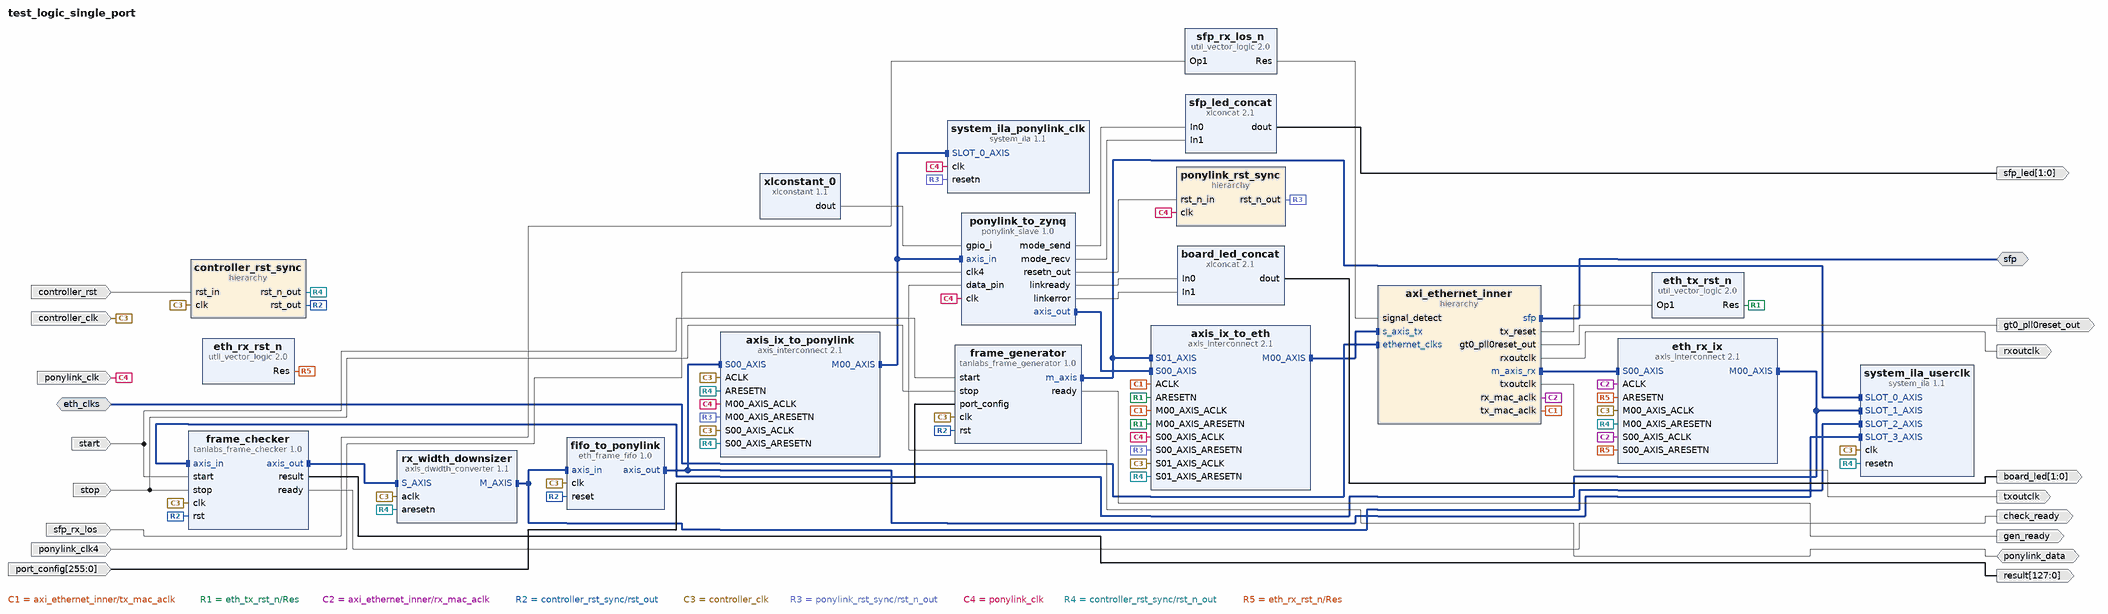
[diagram p0: block diagram of the top level]
# Vivado block design test_logic_single_port, xc7a200tfbg676-2, Vivado 2019.2
create_bd_design test_logic_single_port

create_bd_intf_port -mode Master -vlnv xilinx.com:interface:sfp_rtl:1.0 sfp
create_bd_intf_port -mode Slave -vlnv harrychen.xyz:user:axi_ethernet_clocks_resets_rtl:1.0 eth_clks
create_bd_port -dir IO -type data ponylink_data
create_bd_port -dir I sfp_rx_los
create_bd_port -dir O -type clk rxoutclk
create_bd_port -dir O -type clk txoutclk
create_bd_port -dir O -type rst gt0_pll0reset_out
create_bd_port -dir I -type data start
create_bd_port -dir I -type data stop
create_bd_port -dir I -from 255 -to 0 -type data port_config
create_bd_port -dir O -from 127 -to 0 -type data result
create_bd_port -dir O -type data check_ready
create_bd_port -dir O -type data gen_ready
create_bd_port -dir O -from 1 -to 0 -type data sfp_led
create_bd_port -dir O -from 1 -to 0 -type data board_led
create_bd_port -dir I -type clk ponylink_clk
set_property -dict {CONFIG.FREQ_HZ 33000000} [get_bd_ports ponylink_clk]
create_bd_port -dir I -type clk ponylink_clk4
set_property -dict {CONFIG.FREQ_HZ 132000000} [get_bd_ports ponylink_clk4]
create_bd_port -dir I -type clk controller_clk
set_property -dict {CONFIG.ASSOCIATED_RESET controller_rst CONFIG.FREQ_HZ 33000000} [get_bd_ports controller_clk]
create_bd_port -dir I -type rst controller_rst
set_property -dict {CONFIG.POLARITY ACTIVE_HIGH} [get_bd_ports controller_rst]

create_bd_cell -type ip -vlnv clifford.at:cliffordwolf:ponylink_slave:1.0 ponylink_to_zynq
set_property -dict [list \
  CONFIG.MASTER_PARBITS 4 \
  CONFIG.MASTER_TIMINGS 0x09070503010907050301 \
  CONFIG.SLAVE_PARBITS 4 \
  CONFIG.SLAVE_TIMINGS 0x0d0a0705020b09060301 \
  CONFIG.TDATA_WIDTH 8 \
  CONFIG.TUSER_WIDTH 1 \
] [get_bd_cells ponylink_to_zynq]
create_bd_cell -type hier axi_ethernet_inner
create_bd_cell -type ip -vlnv xilinx.com:ip:util_vector_logic:2.0 sfp_rx_los_n
set_property -dict {CONFIG.C_OPERATION not CONFIG.C_SIZE 1} [get_bd_cells sfp_rx_los_n]
create_bd_cell -type ip -vlnv xilinx.com:ip:axis_interconnect:2.1 axis_ix_to_eth
set_property -dict [list \
  CONFIG.ARB_ALGORITHM 1 \
  CONFIG.ARB_ON_MAX_XFERS 0 \
  CONFIG.ARB_ON_TLAST 1 \
  CONFIG.ENABLE_ADVANCED_OPTIONS 1 \
  CONFIG.M00_FIFO_DEPTH 4096 \
  CONFIG.M00_FIFO_MODE 1 \
  CONFIG.NUM_MI 1 \
  CONFIG.NUM_SI 2 \
  CONFIG.XBAR_TDATA_NUM_BYTES 1 \
] [get_bd_cells axis_ix_to_eth]
create_bd_cell -type ip -vlnv xilinx.com:ip:xlconstant:1.1 xlconstant_0
set_property -dict {CONFIG.CONST_VAL 0 CONFIG.CONST_WIDTH 8} [get_bd_cells xlconstant_0]
create_bd_cell -type ip -vlnv user.org:user:eth_frame_fifo:1.0 fifo_to_ponylink
set_property -dict {CONFIG.DATA_WIDTH 64} [get_bd_cells fifo_to_ponylink]
create_bd_cell -type ip -vlnv xilinx.com:ip:xlconcat:2.1 sfp_led_concat
create_bd_cell -type ip -vlnv xilinx.com:ip:xlconcat:2.1 board_led_concat
create_bd_cell -type ip -vlnv xilinx.com:ip:axis_dwidth_converter:1.1 rx_width_downsizer
set_property -dict {CONFIG.M_TDATA_NUM_BYTES 8} [get_bd_cells rx_width_downsizer]
create_bd_cell -type ip -vlnv xilinx.com:ip:axis_interconnect:2.1 eth_rx_ix
set_property -dict {CONFIG.NUM_MI 1} [get_bd_cells eth_rx_ix]
create_bd_cell -type hier ponylink_rst_sync
create_bd_cell -type ip -vlnv xilinx.com:ip:axis_interconnect:2.1 axis_ix_to_ponylink
set_property -dict {CONFIG.ARB_ON_MAX_XFERS 0 CONFIG.NUM_MI 1} [get_bd_cells axis_ix_to_ponylink]
create_bd_cell -type ip -vlnv harrychen.xyz:user:tanlabs_frame_checker:1.0 frame_checker
set_property -dict {CONFIG.DATA_WIDTH 512} [get_bd_cells frame_checker]
create_bd_cell -type ip -vlnv harrychen.xyz:user:tanlabs_frame_generator:1.0 frame_generator
set_property -dict {CONFIG.DATA_WIDTH 512} [get_bd_cells frame_generator]
create_bd_cell -type ip -vlnv xilinx.com:ip:util_vector_logic:2.0 eth_tx_rst_n
set_property -dict {CONFIG.C_OPERATION not CONFIG.C_SIZE 1} [get_bd_cells eth_tx_rst_n]
create_bd_cell -type ip -vlnv xilinx.com:ip:util_vector_logic:2.0 eth_rx_rst_n
set_property -dict {CONFIG.C_OPERATION not CONFIG.C_SIZE 1} [get_bd_cells eth_rx_rst_n]
create_bd_cell -type hier controller_rst_sync
create_bd_cell -type ip -vlnv xilinx.com:ip:system_ila:1.1 system_ila_ponylink_clk
set_property -dict [list \
  CONFIG.C_MON_TYPE INTERFACE \
  CONFIG.C_NUM_MONITOR_SLOTS 1 \
  CONFIG.C_SLOT 0 \
  CONFIG.C_SLOT_0_APC_EN 1 \
  CONFIG.C_SLOT_0_AXI_DATA_SEL 1 \
  CONFIG.C_SLOT_0_AXI_TRIG_SEL 1 \
  CONFIG.C_SLOT_0_INTF_TYPE xilinx.com:interface:axis_rtl:1.0 \
  CONFIG.C_SLOT_1_APC_EN 1 \
  CONFIG.C_SLOT_1_INTF_TYPE xilinx.com:interface:axis_rtl:1.0 \
  CONFIG.C_SLOT_2_APC_EN 1 \
  CONFIG.C_SLOT_2_INTF_TYPE xilinx.com:interface:axis_rtl:1.0 \
  CONFIG.C_SLOT_3_APC_EN 0 \
  CONFIG.C_SLOT_3_AXI_DATA_SEL 1 \
  CONFIG.C_SLOT_3_AXI_TRIG_SEL 1 \
  CONFIG.C_SLOT_3_INTF_TYPE xilinx.com:interface:axis_rtl:1.0 \
  CONFIG.C_SLOT_4_APC_EN 1 \
  CONFIG.C_SLOT_4_INTF_TYPE xilinx.com:interface:axis_rtl:1.0 \
] [get_bd_cells system_ila_ponylink_clk]
create_bd_cell -type ip -vlnv xilinx.com:ip:system_ila:1.1 system_ila_userclk
set_property -dict [list \
  CONFIG.C_MON_TYPE INTERFACE \
  CONFIG.C_NUM_MONITOR_SLOTS 4 \
  CONFIG.C_SLOT_0_APC_EN 1 \
  CONFIG.C_SLOT_0_AXI_DATA_SEL 1 \
  CONFIG.C_SLOT_0_AXI_TRIG_SEL 1 \
  CONFIG.C_SLOT_0_INTF_TYPE xilinx.com:interface:axis_rtl:1.0 \
  CONFIG.C_SLOT_1_APC_EN 1 \
  CONFIG.C_SLOT_1_AXI_DATA_SEL 1 \
  CONFIG.C_SLOT_1_AXI_TRIG_SEL 1 \
  CONFIG.C_SLOT_1_INTF_TYPE xilinx.com:interface:axis_rtl:1.0 \
  CONFIG.C_SLOT_2_APC_EN 1 \
  CONFIG.C_SLOT_2_AXI_DATA_SEL 1 \
  CONFIG.C_SLOT_2_AXI_TRIG_SEL 1 \
  CONFIG.C_SLOT_2_INTF_TYPE xilinx.com:interface:axis_rtl:1.0 \
  CONFIG.C_SLOT_3_APC_EN 1 \
  CONFIG.C_SLOT_3_AXI_DATA_SEL 1 \
  CONFIG.C_SLOT_3_AXI_TRIG_SEL 1 \
  CONFIG.C_SLOT_3_INTF_TYPE xilinx.com:interface:axis_rtl:1.0 \
] [get_bd_cells system_ila_userclk]

# ---- hierarchy /axi_ethernet_inner ----
current_bd_instance /axi_ethernet_inner
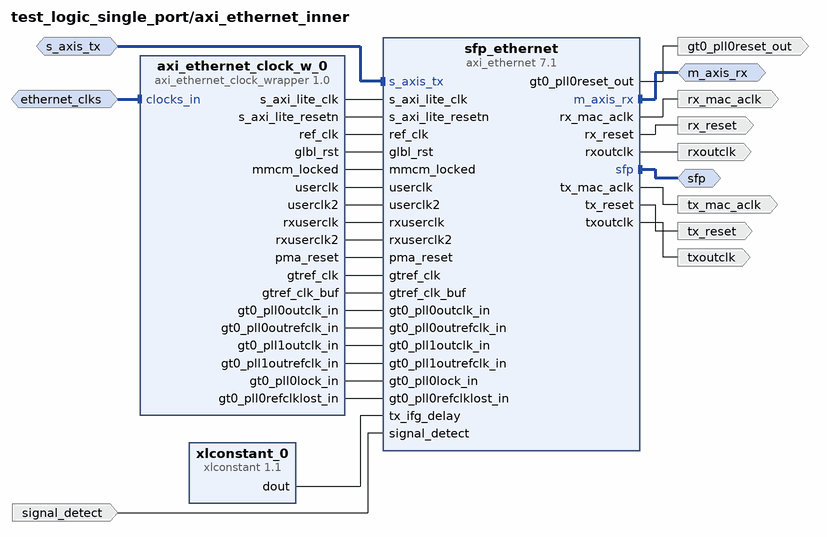
[diagram p1: block diagram inside /axi_ethernet_inner]
create_bd_intf_pin -mode Master -vlnv xilinx.com:interface:axis_rtl:1.0 m_axis_rx
create_bd_intf_pin -mode Slave -vlnv xilinx.com:interface:axis_rtl:1.0 s_axis_tx
create_bd_intf_pin -mode Master -vlnv xilinx.com:interface:sfp_rtl:1.0 sfp
create_bd_intf_pin -mode Slave -vlnv harrychen.xyz:user:axi_ethernet_clocks_resets_rtl:1.0 ethernet_clks
create_bd_pin -dir I signal_detect
create_bd_pin -dir O -type clk tx_mac_aclk
create_bd_pin -dir O -type rst tx_reset
create_bd_pin -dir O -type clk rx_mac_aclk
create_bd_pin -dir O -type rst rx_reset
create_bd_pin -dir O -type clk rxoutclk
create_bd_pin -dir O -type clk txoutclk
create_bd_pin -dir O -type rst gt0_pll0reset_out

create_bd_cell -type ip -vlnv xilinx.com:ip:axi_ethernet:7.1 sfp_ethernet
set_property -dict [list \
  CONFIG.Frame_Filter false \
  CONFIG.PHY_TYPE 1000BaseX \
  CONFIG.SupportLevel 0 \
  CONFIG.axiliteclkrate 200 \
  CONFIG.processor_mode false \
] [get_bd_cells sfp_ethernet]
create_bd_cell -type ip -vlnv xilinx.com:ip:xlconstant:1.1 xlconstant_0
set_property -dict {CONFIG.CONST_VAL 0 CONFIG.CONST_WIDTH 8} [get_bd_cells xlconstant_0]
create_bd_cell -type ip -vlnv harrychen.xyz:user:axi_ethernet_clock_wrapper:1.0 axi_ethernet_clock_w_0

# ---- hierarchy /ponylink_rst_sync ----
current_bd_instance /ponylink_rst_sync
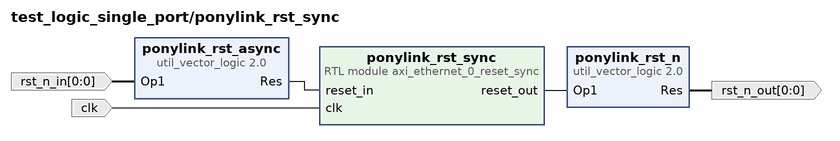
[diagram p2: block diagram inside /ponylink_rst_sync]
create_bd_pin -dir I -type clk clk
create_bd_pin -dir O -from 0 -to 0 rst_n_out
create_bd_pin -dir I -from 0 -to 0 rst_n_in

create_bd_cell -type module -reference axi_ethernet_0_reset_sync ponylink_rst_sync
create_bd_cell -type ip -vlnv xilinx.com:ip:util_vector_logic:2.0 ponylink_rst_n
set_property -dict {CONFIG.C_OPERATION not CONFIG.C_SIZE 1} [get_bd_cells ponylink_rst_n]
create_bd_cell -type ip -vlnv xilinx.com:ip:util_vector_logic:2.0 ponylink_rst_async
set_property -dict {CONFIG.C_OPERATION not CONFIG.C_SIZE 1} [get_bd_cells ponylink_rst_async]

# ---- hierarchy /controller_rst_sync ----
current_bd_instance /controller_rst_sync
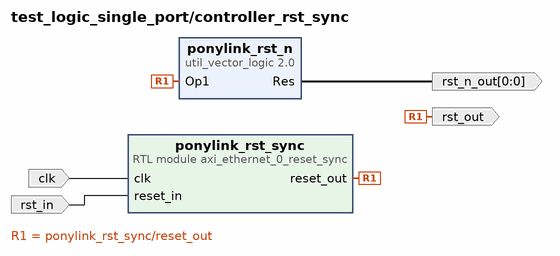
[diagram p3: block diagram inside /controller_rst_sync]
create_bd_pin -dir I -type clk clk
create_bd_pin -dir O -from 0 -to 0 rst_n_out
create_bd_pin -dir O -type rst rst_out
create_bd_pin -dir I -type rst rst_in

create_bd_cell -type module -reference axi_ethernet_0_reset_sync ponylink_rst_sync
create_bd_cell -type ip -vlnv xilinx.com:ip:util_vector_logic:2.0 ponylink_rst_n
set_property -dict {CONFIG.C_OPERATION not CONFIG.C_SIZE 1} [get_bd_cells ponylink_rst_n]

# ---- connections ----

current_bd_instance /axi_ethernet_inner
connect_bd_intf_net [get_bd_intf_pins s_axis_tx] [get_bd_intf_pins sfp_ethernet/s_axis_tx]
connect_bd_intf_net [get_bd_intf_pins ethernet_clks] [get_bd_intf_pins axi_ethernet_clock_w_0/clocks_in]
connect_bd_intf_net [get_bd_intf_pins m_axis_rx] [get_bd_intf_pins sfp_ethernet/m_axis_rx]
connect_bd_intf_net -intf_net axi_ethernet_0_sfp [get_bd_intf_pins sfp] [get_bd_intf_pins sfp_ethernet/sfp]
connect_bd_net [get_bd_pins axi_ethernet_clock_w_0/s_axi_lite_clk] [get_bd_pins sfp_ethernet/s_axi_lite_clk]
connect_bd_net [get_bd_pins axi_ethernet_clock_w_0/s_axi_lite_resetn] [get_bd_pins sfp_ethernet/s_axi_lite_resetn]
connect_bd_net [get_bd_pins axi_ethernet_clock_w_0/ref_clk] [get_bd_pins sfp_ethernet/ref_clk]
connect_bd_net [get_bd_pins axi_ethernet_clock_w_0/glbl_rst] [get_bd_pins sfp_ethernet/glbl_rst]
connect_bd_net [get_bd_pins axi_ethernet_clock_w_0/mmcm_locked] [get_bd_pins sfp_ethernet/mmcm_locked]
connect_bd_net [get_bd_pins axi_ethernet_clock_w_0/userclk] [get_bd_pins sfp_ethernet/userclk]
connect_bd_net [get_bd_pins axi_ethernet_clock_w_0/userclk2] [get_bd_pins sfp_ethernet/userclk2]
connect_bd_net [get_bd_pins axi_ethernet_clock_w_0/rxuserclk] [get_bd_pins sfp_ethernet/rxuserclk]
connect_bd_net [get_bd_pins axi_ethernet_clock_w_0/rxuserclk2] [get_bd_pins sfp_ethernet/rxuserclk2]
connect_bd_net [get_bd_pins axi_ethernet_clock_w_0/pma_reset] [get_bd_pins sfp_ethernet/pma_reset]
connect_bd_net [get_bd_pins axi_ethernet_clock_w_0/gtref_clk] [get_bd_pins sfp_ethernet/gtref_clk]
connect_bd_net [get_bd_pins axi_ethernet_clock_w_0/gtref_clk_buf] [get_bd_pins sfp_ethernet/gtref_clk_buf]
connect_bd_net [get_bd_pins axi_ethernet_clock_w_0/gt0_pll0outclk_in] [get_bd_pins sfp_ethernet/gt0_pll0outclk_in]
connect_bd_net [get_bd_pins axi_ethernet_clock_w_0/gt0_pll0outrefclk_in] [get_bd_pins sfp_ethernet/gt0_pll0outrefclk_in]
connect_bd_net [get_bd_pins axi_ethernet_clock_w_0/gt0_pll1outclk_in] [get_bd_pins sfp_ethernet/gt0_pll1outclk_in]
connect_bd_net [get_bd_pins axi_ethernet_clock_w_0/gt0_pll1outrefclk_in] [get_bd_pins sfp_ethernet/gt0_pll1outrefclk_in]
connect_bd_net [get_bd_pins axi_ethernet_clock_w_0/gt0_pll0lock_in] [get_bd_pins sfp_ethernet/gt0_pll0lock_in]
connect_bd_net [get_bd_pins axi_ethernet_clock_w_0/gt0_pll0refclklost_in] [get_bd_pins sfp_ethernet/gt0_pll0refclklost_in]
connect_bd_net [get_bd_pins signal_detect] [get_bd_pins sfp_ethernet/signal_detect]
connect_bd_net [get_bd_pins xlconstant_0/dout] [get_bd_pins sfp_ethernet/tx_ifg_delay]
connect_bd_net [get_bd_pins sfp_ethernet/tx_mac_aclk] [get_bd_pins tx_mac_aclk]
connect_bd_net [get_bd_pins sfp_ethernet/tx_reset] [get_bd_pins tx_reset]
connect_bd_net [get_bd_pins sfp_ethernet/rx_mac_aclk] [get_bd_pins rx_mac_aclk]
connect_bd_net [get_bd_pins sfp_ethernet/rx_reset] [get_bd_pins rx_reset]
connect_bd_net [get_bd_pins sfp_ethernet/rxoutclk] [get_bd_pins rxoutclk]
connect_bd_net [get_bd_pins sfp_ethernet/txoutclk] [get_bd_pins txoutclk]
connect_bd_net [get_bd_pins sfp_ethernet/gt0_pll0reset_out] [get_bd_pins gt0_pll0reset_out]

current_bd_instance /ponylink_rst_sync
connect_bd_net -net util_vector_logic_0_Res1 [get_bd_pins ponylink_rst_async/Res] [get_bd_pins ponylink_rst_sync/reset_in]
connect_bd_net -net rx_reset_sync1_reset_out [get_bd_pins ponylink_rst_sync/reset_out] [get_bd_pins ponylink_rst_n/Op1]
connect_bd_net -net ponylink_clk [get_bd_pins clk] [get_bd_pins ponylink_rst_sync/clk]
connect_bd_net [get_bd_pins ponylink_rst_n/Res] [get_bd_pins rst_n_out]
connect_bd_net -net ponylink_to_zynq_resetn_out [get_bd_pins rst_n_in] [get_bd_pins ponylink_rst_async/Op1]

current_bd_instance /controller_rst_sync
connect_bd_net -net rx_reset_sync1_reset_out [get_bd_pins ponylink_rst_sync/reset_out] [get_bd_pins ponylink_rst_n/Op1] [get_bd_pins rst_out]
connect_bd_net -net ponylink_clk [get_bd_pins clk] [get_bd_pins ponylink_rst_sync/clk]
connect_bd_net [get_bd_pins ponylink_rst_n/Res] [get_bd_pins rst_n_out]
connect_bd_net -net controller_rst_1 [get_bd_pins rst_in] [get_bd_pins ponylink_rst_sync/reset_in]

current_bd_instance /
connect_bd_intf_net [get_bd_intf_ports eth_clks] [get_bd_intf_pins axi_ethernet_inner/ethernet_clks]
connect_bd_intf_net -intf_net axis_interconnect_0_M00_AXIS [get_bd_intf_pins axis_ix_to_eth/M00_AXIS] [get_bd_intf_pins axi_ethernet_inner/s_axis_tx]
connect_bd_intf_net -intf_net axis_interconnect_0_M00_AXIS1 [get_bd_intf_pins eth_rx_ix/M00_AXIS] [get_bd_intf_pins frame_checker/axis_in]
connect_bd_intf_net [get_bd_intf_pins eth_rx_ix/M00_AXIS] [get_bd_intf_pins system_ila_userclk/SLOT_1_AXIS]
connect_bd_intf_net -intf_net axi_ethernet_0_sfp [get_bd_intf_ports sfp] [get_bd_intf_pins axi_ethernet_inner/sfp]
connect_bd_intf_net -intf_net frame_generator_m_axis [get_bd_intf_pins frame_generator/m_axis] [get_bd_intf_pins axis_ix_to_eth/S01_AXIS]
connect_bd_intf_net [get_bd_intf_pins frame_generator/m_axis] [get_bd_intf_pins system_ila_userclk/SLOT_0_AXIS]
connect_bd_intf_net [get_bd_intf_pins ponylink_to_zynq/axis_out] [get_bd_intf_pins axis_ix_to_eth/S00_AXIS]
connect_bd_intf_net -intf_net rx_width_upsizer1_M_AXIS [get_bd_intf_pins rx_width_downsizer/M_AXIS] [get_bd_intf_pins fifo_to_ponylink/axis_in]
connect_bd_intf_net [get_bd_intf_pins rx_width_downsizer/M_AXIS] [get_bd_intf_pins system_ila_userclk/SLOT_2_AXIS]
connect_bd_intf_net -intf_net axis_ix_to_ponylink_M00_AXIS [get_bd_intf_pins axis_ix_to_ponylink/M00_AXIS] [get_bd_intf_pins ponylink_to_zynq/axis_in]
connect_bd_intf_net [get_bd_intf_pins axis_ix_to_ponylink/M00_AXIS] [get_bd_intf_pins system_ila_ponylink_clk/SLOT_0_AXIS]
connect_bd_intf_net -intf_net fifo_to_ponylink_axis_out [get_bd_intf_pins fifo_to_ponylink/axis_out] [get_bd_intf_pins axis_ix_to_ponylink/S00_AXIS]
connect_bd_intf_net [get_bd_intf_pins fifo_to_ponylink/axis_out] [get_bd_intf_pins system_ila_userclk/SLOT_3_AXIS]
connect_bd_intf_net [get_bd_intf_pins axi_ethernet_inner/m_axis_rx] [get_bd_intf_pins eth_rx_ix/S00_AXIS]
connect_bd_intf_net [get_bd_intf_pins frame_checker/axis_out] [get_bd_intf_pins rx_width_downsizer/S_AXIS]
connect_bd_net [get_bd_ports ponylink_data] [get_bd_pins ponylink_to_zynq/data_pin]
connect_bd_net [get_bd_ports sfp_rx_los] [get_bd_pins sfp_rx_los_n/Op1]
connect_bd_net -net util_vector_logic_0_Res [get_bd_pins sfp_rx_los_n/Res] [get_bd_pins axi_ethernet_inner/signal_detect]
connect_bd_net [get_bd_pins ponylink_to_zynq/resetn_out] [get_bd_pins ponylink_rst_sync/rst_n_in]
connect_bd_net -net M00_AXIS_ACLK_1 [get_bd_pins axi_ethernet_inner/tx_mac_aclk] \
  [get_bd_pins axis_ix_to_eth/M00_AXIS_ACLK] [get_bd_pins axis_ix_to_eth/ACLK]
connect_bd_net -net util_vector_logic_1_Res [get_bd_pins eth_tx_rst_n/Res] \
  [get_bd_pins axis_ix_to_eth/M00_AXIS_ARESETN] [get_bd_pins axis_ix_to_eth/ARESETN]
connect_bd_net -net ACLK_1 [get_bd_pins axi_ethernet_inner/rx_mac_aclk] [get_bd_pins eth_rx_ix/ACLK] [get_bd_pins eth_rx_ix/S00_AXIS_ACLK]
connect_bd_net -net axi_ethernet_inner_rx_reset [get_bd_pins controller_rst_sync/rst_out] \
  [get_bd_pins fifo_to_ponylink/reset] [get_bd_pins frame_checker/rst] [get_bd_pins frame_generator/rst]
connect_bd_net [get_bd_pins xlconstant_0/dout] [get_bd_pins ponylink_to_zynq/gpio_i]
connect_bd_net [get_bd_pins axi_ethernet_inner/rxoutclk] [get_bd_ports rxoutclk]
connect_bd_net -net axi_ethernet_inner_txoutclk [get_bd_ports controller_clk] \
  [get_bd_pins axis_ix_to_eth/S01_AXIS_ACLK] [get_bd_pins axis_ix_to_ponylink/S00_AXIS_ACLK] \
  [get_bd_pins axis_ix_to_ponylink/ACLK] [get_bd_pins eth_rx_ix/M00_AXIS_ACLK] [get_bd_pins controller_rst_sync/clk] \
  [get_bd_pins frame_checker/clk] [get_bd_pins frame_generator/clk] [get_bd_pins rx_width_downsizer/aclk] \
  [get_bd_pins fifo_to_ponylink/clk] [get_bd_pins system_ila_userclk/clk]
connect_bd_net [get_bd_pins axi_ethernet_inner/gt0_pll0reset_out] [get_bd_ports gt0_pll0reset_out]
connect_bd_net [get_bd_ports start] [get_bd_pins frame_checker/start] [get_bd_pins frame_generator/start]
connect_bd_net [get_bd_ports stop] [get_bd_pins frame_checker/stop] [get_bd_pins frame_generator/stop]
connect_bd_net [get_bd_ports port_config] [get_bd_pins frame_generator/port_config]
connect_bd_net -net tanlabs_frame_checker_0_result [get_bd_pins frame_checker/result] [get_bd_ports result]
connect_bd_net -net tanlabs_frame_checker_0_ready [get_bd_pins frame_checker/ready] [get_bd_ports check_ready]
connect_bd_net -net tanlabs_frame_genera_0_ready [get_bd_pins frame_generator/ready] [get_bd_ports gen_ready]
connect_bd_net [get_bd_pins ponylink_to_zynq/mode_send] [get_bd_pins sfp_led_concat/In0]
connect_bd_net [get_bd_pins ponylink_to_zynq/mode_recv] [get_bd_pins sfp_led_concat/In1]
connect_bd_net [get_bd_pins ponylink_to_zynq/linkready] [get_bd_pins board_led_concat/In0]
connect_bd_net [get_bd_pins ponylink_to_zynq/linkerror] [get_bd_pins board_led_concat/In1]
connect_bd_net [get_bd_pins sfp_led_concat/dout] [get_bd_ports sfp_led]
connect_bd_net [get_bd_pins board_led_concat/dout] [get_bd_ports board_led]
connect_bd_net [get_bd_ports ponylink_clk4] [get_bd_pins ponylink_to_zynq/clk4]
connect_bd_net -net ponylink_rst_n_Res [get_bd_pins ponylink_rst_sync/rst_n_out] \
  [get_bd_pins axis_ix_to_eth/S00_AXIS_ARESETN] [get_bd_pins axis_ix_to_ponylink/M00_AXIS_ARESETN] \
  [get_bd_pins system_ila_ponylink_clk/resetn]
connect_bd_net [get_bd_ports ponylink_clk] \
  [get_bd_pins ponylink_to_zynq/clk] [get_bd_pins axis_ix_to_eth/S00_AXIS_ACLK] \
  [get_bd_pins axis_ix_to_ponylink/M00_AXIS_ACLK] [get_bd_pins ponylink_rst_sync/clk] \
  [get_bd_pins system_ila_ponylink_clk/clk]
connect_bd_net -net eth_rx_rst_n_Res [get_bd_pins controller_rst_sync/rst_n_out] \
  [get_bd_pins rx_width_downsizer/aresetn] [get_bd_pins axis_ix_to_ponylink/S00_AXIS_ARESETN] \
  [get_bd_pins eth_rx_ix/M00_AXIS_ARESETN] [get_bd_pins axis_ix_to_eth/S01_AXIS_ARESETN] \
  [get_bd_pins axis_ix_to_ponylink/ARESETN] [get_bd_pins system_ila_userclk/resetn]
connect_bd_net [get_bd_pins axi_ethernet_inner/tx_reset] [get_bd_pins eth_tx_rst_n/Op1]
connect_bd_net [get_bd_pins eth_rx_rst_n/Res] [get_bd_pins eth_rx_ix/S00_AXIS_ARESETN] [get_bd_pins eth_rx_ix/ARESETN]
connect_bd_net [get_bd_pins axi_ethernet_inner/txoutclk] [get_bd_ports txoutclk]
connect_bd_net [get_bd_ports controller_rst] [get_bd_pins controller_rst_sync/rst_in]
set_property HDL_ATTRIBUTE.DEBUG true [get_bd_intf_nets axis_interconnect_0_M00_AXIS1]
set_property HDL_ATTRIBUTE.MARK_DEBUG true [get_bd_intf_nets axis_interconnect_0_M00_AXIS1]
set_property HDL_ATTRIBUTE.DEBUG true [get_bd_intf_nets frame_generator_m_axis]
set_property HDL_ATTRIBUTE.MARK_DEBUG true [get_bd_intf_nets frame_generator_m_axis]
set_property HDL_ATTRIBUTE.DEBUG true [get_bd_intf_nets rx_width_upsizer1_M_AXIS]
set_property HDL_ATTRIBUTE.MARK_DEBUG true [get_bd_intf_nets rx_width_upsizer1_M_AXIS]
set_property HDL_ATTRIBUTE.DEBUG true [get_bd_intf_nets axis_ix_to_ponylink_M00_AXIS]
set_property HDL_ATTRIBUTE.MARK_DEBUG true [get_bd_intf_nets axis_ix_to_ponylink_M00_AXIS]
set_property HDL_ATTRIBUTE.DEBUG true [get_bd_intf_nets fifo_to_ponylink_axis_out]
set_property HDL_ATTRIBUTE.MARK_DEBUG true [get_bd_intf_nets fifo_to_ponylink_axis_out]

validate_bd_design
save_bd_design
